# Altium schematic sheet STM32_Lvl-Shft_HUB75.SchDoc
size A; SheetNumber: 4; SheetTotal: 5
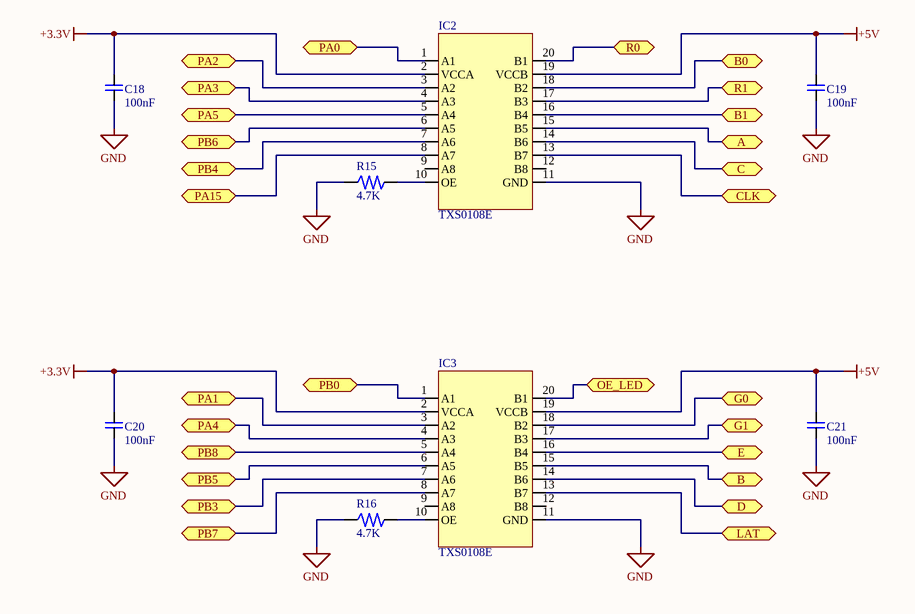
[diagram p0: STM32_Lvl-Shft_HUB75.SchDoc]

## Parts
C18  100nF  [SMT_CAP_MODEL_1206(3216)_SAMSUNG]
C19  100nF  [SMT_CAP_MODEL_1206(3216)_SAMSUNG]
C20  100nF  [SMT_CAP_MODEL_1206(3216)_SAMSUNG]
C21  100nF  [SMT_CAP_MODEL_1206(3216)_SAMSUNG]
IC2  TXS0108E  [SMT_TXS0108E_IC]
IC3  TXS0108E  [SMT_TXS0108E_IC]
R15  4.7K  [SMT_RES_MODEL_1206(3216)_ROHM]
R16  4.7K  [SMT_RES_MODEL_1206(3216)_ROHM]

## Ports
A (bidir), B0 (bidir), B1 (bidir), B (bidir), C (bidir), CLK (bidir), D (bidir), E (bidir), G0 (bidir), G1 (bidir), LAT (bidir), OE_LED (bidir), PA0 (bidir), PA1 (bidir), PA2 (bidir), PA3 (bidir), PA4 (bidir), PA5 (bidir), PA15 (bidir), PB0 (bidir), PB3 (bidir), PB4 (bidir), PB5 (bidir), PB6 (bidir), PB7 (bidir), PB8 (bidir), R0 (bidir), R1 (bidir)

## Nets
+3.3V: C18.1 C20.1 IC2.2(VCCA) IC3.2(VCCA)
+5V: C19.1 C21.1 IC2.19(VCCB) IC3.19(VCCB)
GND: C18.2 C19.2 C20.2 C21.2 IC2.11(GND) IC3.11(GND) R15.2 R16.2
A: IC2.15(B5) ; port A
B: IC3.15(B5) ; port B
B0: IC2.18(B2) ; port B0
B1: IC2.16(B4) ; port B1
C: IC2.14(B6) ; port C
CLK: IC2.13(B7) ; port CLK
D: IC3.14(B6) ; port D
E: IC3.16(B4) ; port E
G0: IC3.18(B2) ; port G0
G1: IC3.17(B3) ; port G1
LAT: IC3.13(B7) ; port LAT
OE_LED: IC3.20(B1) ; port OE_LED
PA0: IC2.1(A1) ; port PA0
PA1: IC3.3(A2) ; port PA1
PA2: IC2.3(A2) ; port PA2
PA3: IC2.4(A3) ; port PA3
PA4: IC3.4(A3) ; port PA4
PA5: IC2.5(A4) ; port PA5
PA15: IC2.8(A7) ; port PA15
PB0: IC3.1(A1) ; port PB0
PB3: IC3.7(A6) ; port PB3
PB4: IC2.7(A6) ; port PB4
PB5: IC3.6(A5) ; port PB5
PB6: IC2.6(A5) ; port PB6
PB7: IC3.8(A7) ; port PB7
PB8: IC3.5(A4) ; port PB8
R0: IC2.20(B1) ; port R0
R1: IC2.17(B3) ; port R1
NetIC2_10: IC2.10(OE) R15.1
NetIC3_10: IC3.10(OE) R16.1

Not connected (* = marked no-connect by the designer): IC2 9(A8) 12(B8); IC3 9(A8) 12(B8)

## Library data of the parts
C18-C21 = SMT_CAP_MODEL_1206(3216)_SAMSUNG: SMT Samsung Ceramic Capacitor MODEL *V *nF 1206(3216)  CL31B104KBCNNNC(etc.)
IC2 IC3 = SMT_TXS0108E_IC: TXS0108E 8-BIT Bi-Directional Level Shifter 1.2-3.6V(A) 1.65-5.5V(B)
R15 R16 = SMT_RES_MODEL_1206(3216)_ROHM: SMT ROHM Resistor MODEL 1206(3216) 1/4W MCR18ERTJ000